# Altium schematic sheet 最小系统2.0.SchDoc
size A3
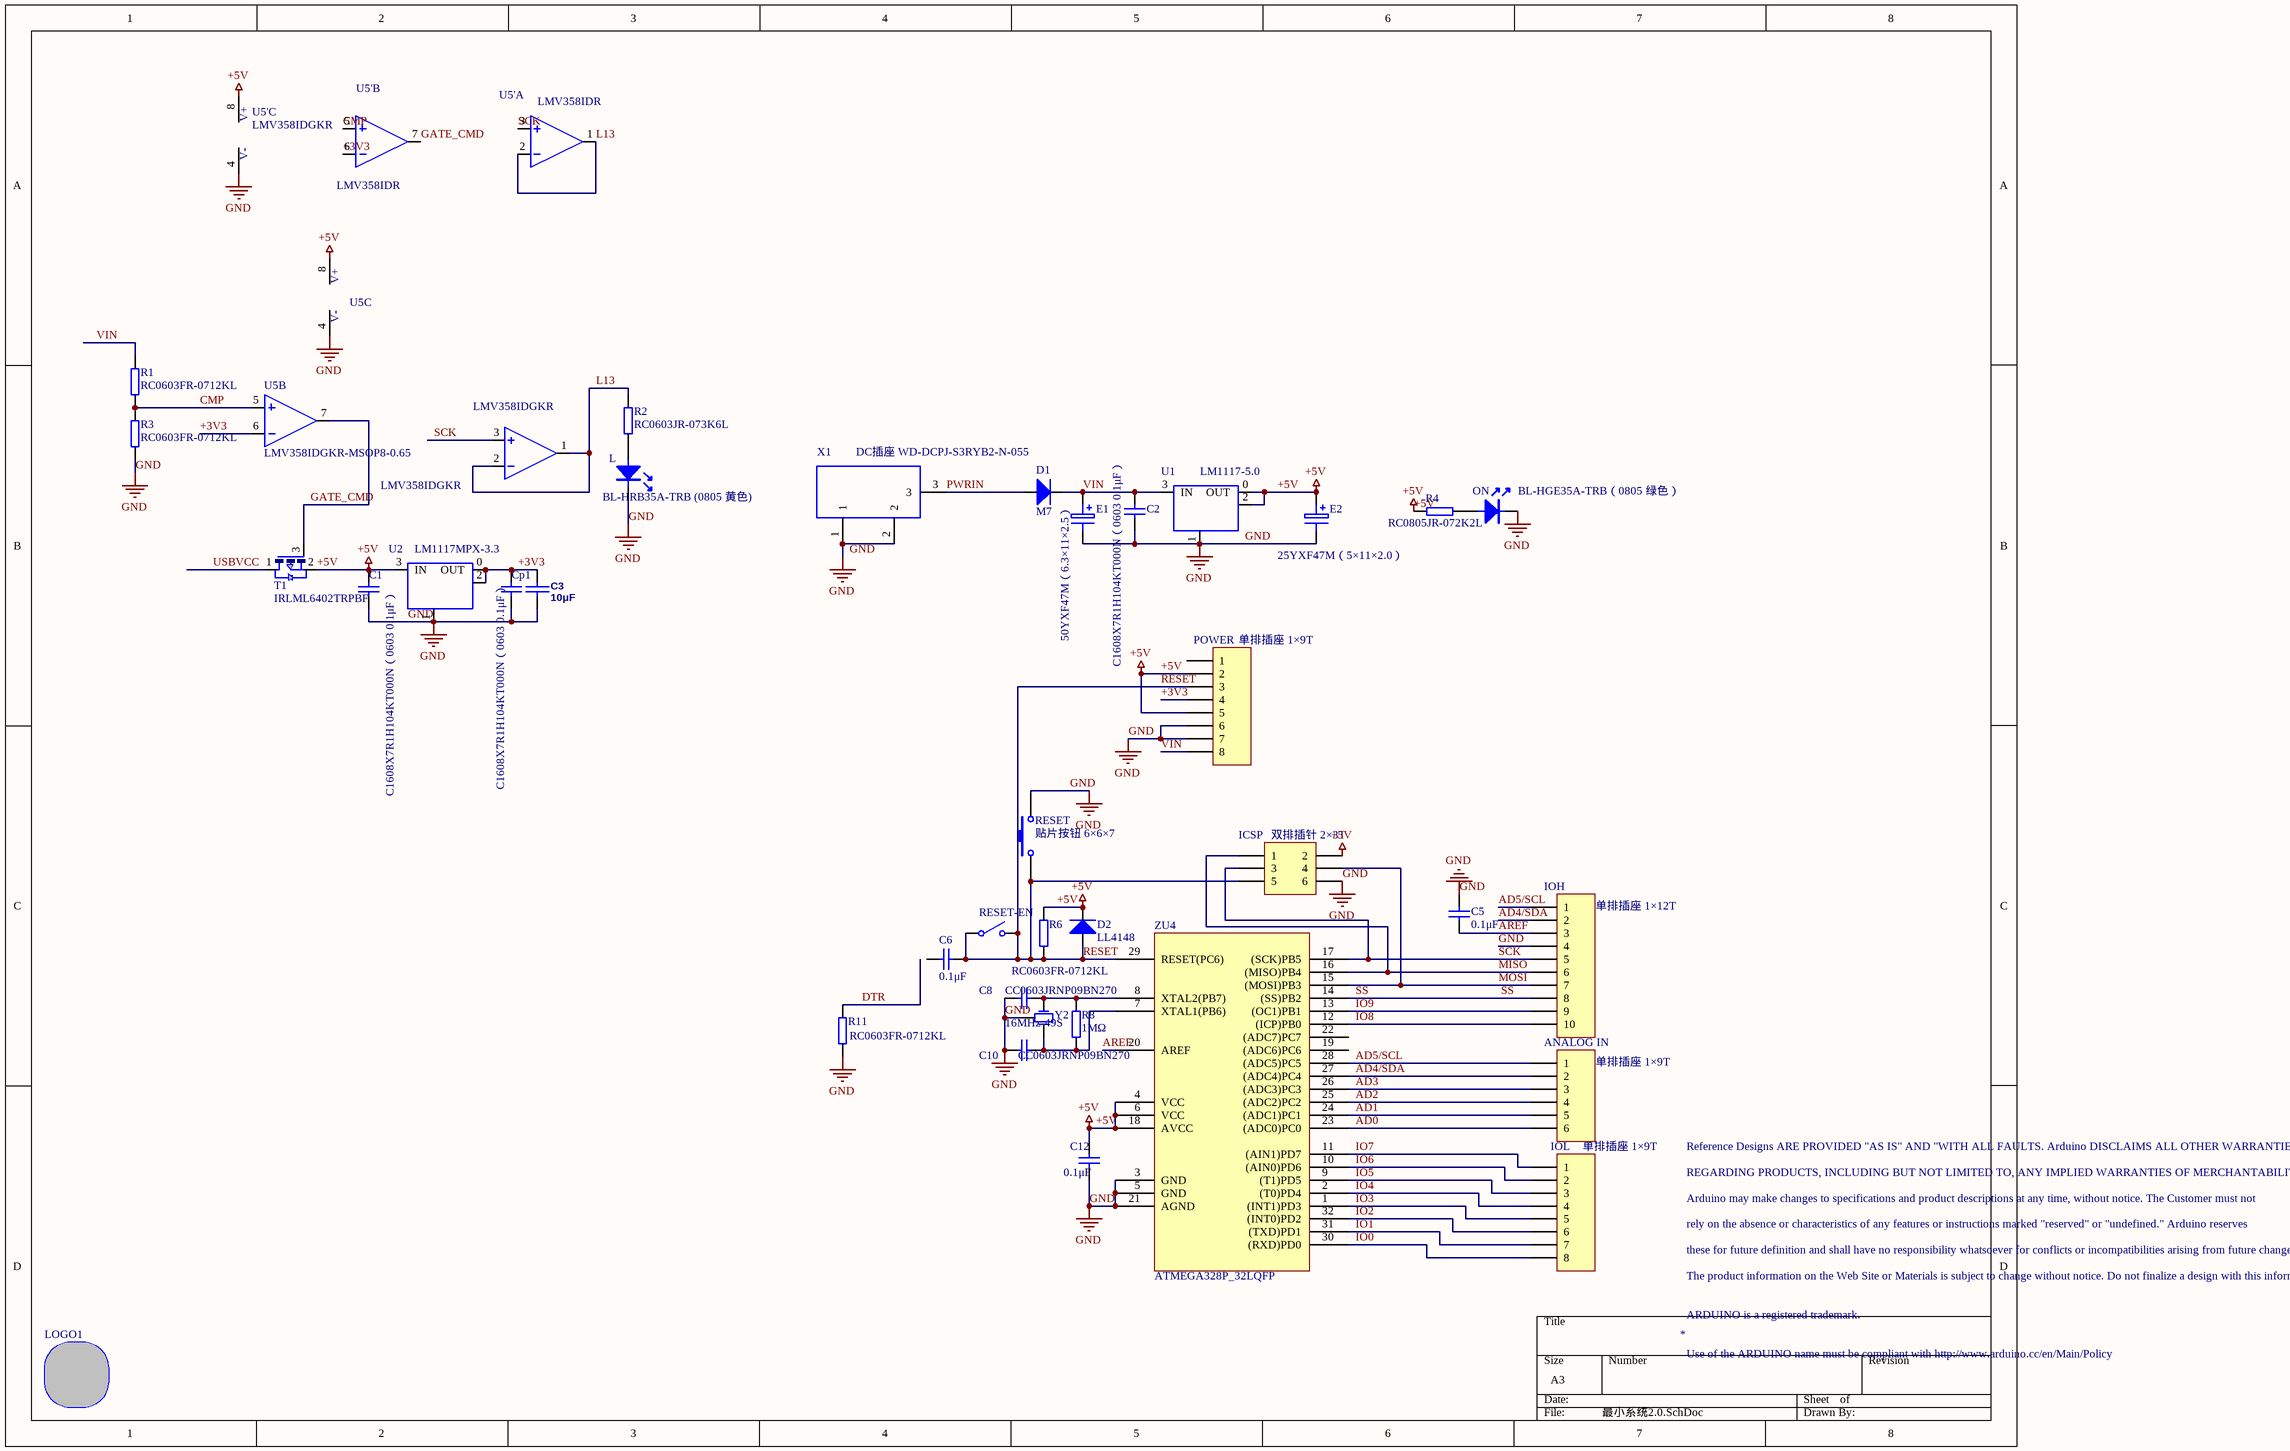
[diagram p0: 最小系统2.0.SchDoc]

## Parts
ANALOG_IN  单排插座 1×9T  [HDR1X6Z]
C1  C1608X7R1H104KT000N（0603 0.1μF）  [0603C]
C2  C1608X7R1H104KT000N（0603 0.1μF）  [0603C]
C3  10μF  [1206C]
C5  0.1μF  [0603C]
C6  0.1μF  [0603C]
C8  CC0603JRNP09BN270  [0603C]
C10  CC0603JRNP09BN270  [0603C]
C12  0.1μF  [0603C]
Cp1  C1608X7R1H104KT000N（0603 0.1μF）  [0603C]
D1  M7  [M7]
D2  LL4148  [D1206]
E1  50YXF47M（6.3×11×2.5）  [RB 6.3×11×2.5]
E2  25YXF47M（5×11×2.0）  [RB 6.3×11×2.5]
ICSP  双排插针 2×3T  [HDR2X3]
IOH  单排插座 1×12T  [HDR1X10Z]
IOL  单排插座 1×9T  [HDR1X8Z]
L  BL-HRB35A-TRB (0805 黄色)  [LED0805-Y]
LOGO1  LOGO  [USB_LOGO]  (value not drawn)
ON  BL-HGE35A-TRB（0805 绿色）  [LED0805-R]
POWER  单排插座 1×9T  [HDR1X8Z]
R1  RC0603FR-0712KL  [0603R]
R2  RC0603JR-073K6L  [0603R]
R3  RC0603FR-0712KL  [0603R]
R4  RC0805JR-072K2L  [0805/R]
R6  RC0603FR-0712KL  [0603R]
R8  1MΩ  [0603R]
R11  RC0603FR-0712KL  [0603R]
RESET  贴片按钮 6×6×7  [按钮/SO]
RESET-EN  (no value)  [0101]
T1  IRLML6402TRPBF  [MOSFET]
U1  LM1117-5.0  [SOT223]
U2  LM1117MPX-3.3  [SOT223]
U5  LMV358IDGKR  [MSOP8-0.65]  (parts A,B,C of 3)
U5'  LMV358IDR  [so-8]  (parts A,B,C of 3)
U$1  *  [MARK]
X1  DC插座 WD-DCPJ-S3RYB2-N-055  [DC_IN]
Y2  16MHz-49S  [XTAL-49S]
ZU4  ATMEGA328P_32LQFP  [LQFP32]

## Nets
+5V: C1.1 C12.2 D2.K E2.1 ICSP.2 POWER.2 POWER.5 R4.2 R6.1 T1.2(S) U1.0(OUT) U1.2(OUT@1) U2.3(IN) U5.8(V+) U5'.8(V+) ZU4.4(VCC) ZU4.6(VCC) ZU4.18(AVCC)
GND: C1.2 C2.1 C3.1 C5.2 C8.1 C10.1 C12.1 Cp1.2 E1.2 E2.2 ICSP.6 IOH.4 L.K ON.K POWER.6 POWER.7 R3.2 R11.2 RESET.2 U1.1(GND/ADJ) U2.1(GND/ADJ) U5.4(V-) U5'.4(V-) X1.1 X1.2 Y2.3 ZU4.3(GND) ZU4.5(GND) ZU4.21(AGND)
+3V3: C3.2 Cp1.1 POWER.4 U2.0(OUT) U2.2(OUT@1) U5.6(-IN) U5'.6(-IN)
AD0: ANALOG_IN.6 ZU4.23((ADC0)PC0)
AD1: ANALOG_IN.5 ZU4.24((ADC1)PC1)
AD2: ANALOG_IN.4 ZU4.25((ADC2)PC2)
AD3: ANALOG_IN.3 ZU4.26((ADC3)PC3)
AD4/SDA: ANALOG_IN.2 IOH.2 ZU4.27((ADC4)PC4)
AD5/SCL: ANALOG_IN.1 IOH.1 ZU4.28((ADC5)PC5)
AREF: C5.1 IOH.3 ZU4.20(AREF)
CMP: R1.2 R3.1 U5.5(+IN) U5'.5(+IN)
DTR: R11.1
GATE_CMD: T1.3(G) U5.7(OUT) U5'.7(OUT)
IO0: IOL.8 ZU4.30((RXD)PD0)
IO1: IOL.7 ZU4.31((TXD)PD1)
IO2: IOL.6 ZU4.32((INT0)PD2)
IO3: IOL.5 ZU4.1((INT1)PD3)
IO4: IOL.4 ZU4.2((T0)PD4)
IO5: IOL.3 ZU4.9((T1)PD5)
IO6: IOL.2 ZU4.10((AIN0)PD6)
IO7: IOL.1 ZU4.11((AIN1)PD7)
IO8: IOH.10 ZU4.12((ICP)PB0)
IO9: IOH.9 ZU4.13((OC1)PB1)
L13: R2.1 U5.1(OUT) U5.2(-IN) U5'.1(OUT) U5'.2(-IN)
MISO: ICSP.1 IOH.6 ZU4.16((MISO)PB4)
MOSI: ICSP.4 IOH.7 ZU4.15((MOSI)PB3)
PWRIN: D1.A X1.3
RESET: C6.2 D2.A ICSP.5 POWER.3 R6.2 RESET.1 RESET-EN.1(COMMON) RESET-EN.2(NO) ZU4.29(RESET(PC6))
SCK: ICSP.3 IOH.5 U5.3(+IN) U5'.3(+IN) ZU4.17((SCK)PB5)
SS: IOH.8 ZU4.14((SS)PB2)
USBVCC: T1.1(D)
VIN: C2.2 D1.K E1.1 POWER.8 R1.1 U1.3(IN)
NetC8_2: C8.2 R8.1 Y2.1(OSC1) ZU4.8(XTAL2(PB7))
NetC10_2: C10.2 R8.2 Y2.2(OSC2) ZU4.7(XTAL1(PB6))
NetL_A: L.A R2.2
NetON_A: ON.A R4.1

Not connected (* = marked no-connect by the designer): C6 1; POWER 1; ZU4 19((ADC6)PC6) 22((ADC7)PC7)

## Notes on the sheet
- (near U$1) Use of the ARDUINO name must be compliant with http://www.arduino.cc/en/Main/Policy
- Labels drawn without touching a wire or pin: GND
- (in symbol DISCLAIMER) Reference Designs ARE PROVIDED "AS IS" AND "WITH ALL FAULTS. Arduino DISCLAIMS ALL OTHER WARRANTIES, EXPRESS OR IMPLIED,; REGARDING PRODUCTS, INCLUDING BUT NOT LIMITED TO, ANY IMPLIED WARRANTIES OF MERCHANTABILITY OR FITNESS FOR A PARTICULAR PURPOSE; Arduino may make changes to specifications and product descriptions at any time, without notice. The Customer must not; rely on the absence or characteristics of any features or instructions marked "reserved" or "undefined." Arduino reserves; these for future definition and shall have no responsibility whatsoever for conflicts or incompatibilities arising from future changes to them.; The product information on the Web Site or Materials is subject to change without notice. Do not finalize a design with this information.; ARDUINO is a registered trademark.

## Library data of the parts
ANALOG_IN = Header 6: Header, 6-Pin; LatestRevisionDate: 17-Jul-2002; LatestRevisionNote: Re-released for DXP Platform.; Publisher: Altium Limited
C1 Cp1 = Cap: Capacitor; Value: 100pF; Published: 8-Jun-2000; LatestRevisionDate: 17-Jul-2002; LatestRevisionNote: Re-released for DXP Platform.; PackageReference: RAD-0.3; Publisher: Altium Limited; PackageDescription: Radial Cap, Thru-Hole; 2 Leads; 0.3 in Pin Spacing
C2 C5 C6 C8 C10 C12 = Cap: Capacitor; Published: 8-Jun-2000; LatestRevisionDate: 17-Jul-2002; LatestRevisionNote: Re-released for DXP Platform.; PackageReference: RAD-0.3; Publisher: Altium Limited; PackageDescription: Radial Cap, Thru-Hole; 2 Leads; 0.3 in Pin Spacing
C3 = CAP: Capacitor
D1 D2 = M7: D
E1 E2 = E
ICSP = Header 3X2: Header, 3-Pin, Dual row; LatestRevisionDate: 17-Jul-2002; LatestRevisionNote: Re-released for DXP Platform.; Publisher: Altium Limited
IOH = Header 10: Header, 10-Pin; LatestRevisionDate: 17-Jul-2002; LatestRevisionNote: Re-released for DXP Platform.; Publisher: Altium Limited
IOL POWER = Header 8: Header, 8-Pin; LatestRevisionDate: 17-Jul-2002; LatestRevisionNote: Re-released for DXP Platform.; Publisher: Altium Limited
L ON = LED
R1-R4 R6 R8 R11 = R: Resistor
RESET = SW-PB: Switch; Published: 24-Mar-1999; LatestRevisionDate: 17-Jul-2002; LatestRevisionNote: Re-released for DXP Platform.; PackageReference: SPST-2; Publisher: Altium Limited; PackageDescription: Switch; 2 Leads
RESET-EN = SW-SPST: Single-Pole, Single-Throw Switch; Published: 24-Mar-1999; LatestRevisionDate: 17-Jul-2002; LatestRevisionNote: Re-released for DXP Platform.; PackageReference: SPST-2; Publisher: Altium Limited; PackageDescription: Switch; 2 Leads
T1 = PMOSSOT23
U1 U2 = LM1117
U5 U5' = LMV358MMX
U$1 = DISCLAIMER
X1 = DC_IN: POWERSUPPLY_DC21MMX
Y2 = XTAL1: 3pXTAL
ZU4 = ATMEGA328P_32LQFP: Arduino ATMEGA328P